# Altium project ESP32-C6-DisplayBoard.PrjPcb
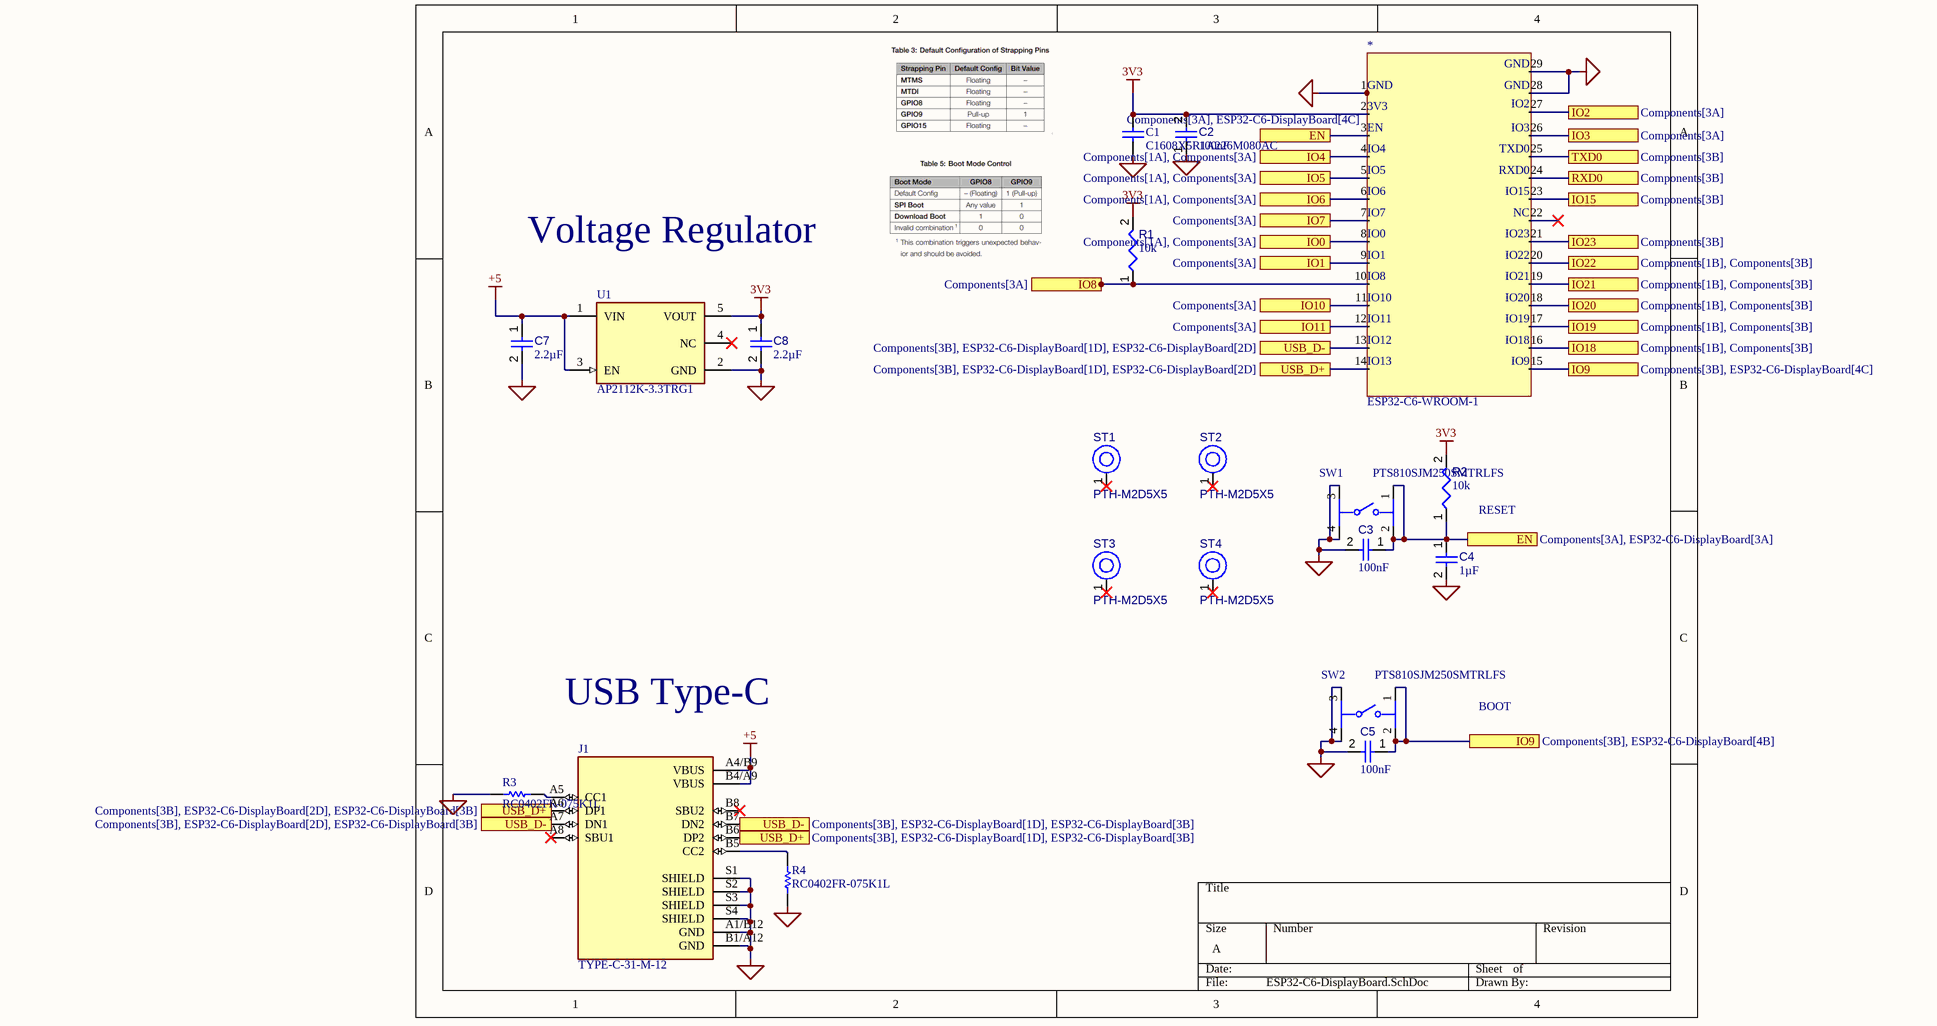
[diagram p0: ESP32-C6-DisplayBoard.SchDoc]
2 sheets, 26 parts. Net scope: flat (ports and power ports of the same name join across sheets).
Board file: ESP32-C6-DisplayBoard.PcbDoc
Sheets:
  ESP32-C6-DisplayBoard.SchDoc
  Components.SchDoc

## Sheet ESP32-C6-DisplayBoard.SchDoc
size A; SheetNumber: 1; SheetTotal: 2

### Parts
*  ESP32-C6-WROOM-1  [PCBComponent_1]
C1  C1608X5R1A226M080AC  [CAPC1608X100X20ML10]
C2  value 100nF  [CAPC1005X56X25LL10T15]  (hidden comment: Capacitor 0.1 uF +/- 5% 16 V 0402)
C3  value 100nF  [CAPC1005X56X25LL10T15]  (hidden comment: Capacitor 0.1 uF +/- 5% 16 V 0402)
C4  value 1µF  [CAPC1005X55X25LL05T10]  (hidden comment: Capacitor 1 uF +/- 10% 6.3 V 0402)
C5  value 100nF  [CAPC1005X56X25LL10T15]  (hidden comment: Capacitor 0.1 uF +/- 5% 16 V 0402)
C7  value 2.2µF  [CAPC0402(1005)60_L]  (hidden comment: Capacitor 2,2µF +/-20% 10V 0402)
C8  value 2.2µF  [CAPC0402(1005)60_L]  (hidden comment: Capacitor 2,2µF +/-20% 10V 0402)
J1  TYPE-C-31-M-12  [HRO_TYPE-C-31-M-12]
R1  value 10k  [RESC0402(1005)_L]  (hidden comment: 10KR2F)
R2  value 10k  [RESC0402(1005)_L]  (hidden comment: 10KR2F)
R3  RC0402FR-075K1L  [RESC1005X40X25NL05T10]
R4  RC0402FR-075K1L  [RESC1005X40X25NL05T10]
ST1  PTH-M2D5X5  [PTH-M2D5X5]
ST2  PTH-M2D5X5  [PTH-M2D5X5]
ST3  PTH-M2D5X5  [PTH-M2D5X5]
ST4  PTH-M2D5X5  [PTH-M2D5X5]
SW1  PTS810SJM250SMTRLFS  [FP-PTS810SJM250SMTRLFS-MFG]
SW2  PTS810SJM250SMTRLFS  [FP-PTS810SJM250SMTRLFS-MFG]
U1  AP2112K-3.3TRG1  [FP-SOT25-IPC_A]

### Ports
EN (see Components[3A], ESP32-C6-DisplayBoard[3A]), EN (see Components[3A], ESP32-C6-DisplayBoard[4C]), IO0 (see Components[1A], Components[3A]), IO1 (see Components[3A]), IO2 (see Components[3A]), IO3 (see Components[3A]), IO4 (see Components[1A], Components[3A]), IO5 (see Components[1A], Components[3A]), IO6 (see Components[1A], Components[3A]), IO7 (see Components[3A]), IO8 (see Components[3A]), IO9 (see Components[3B], ESP32-C6-DisplayBoard[4B]), IO9 (see Components[3B], ESP32-C6-DisplayBoard[4C]), IO10 (see Components[3A]), IO11 (see Components[3A]), IO15 (see Components[3B]), IO18 (see Components[1B], Components[3B]), IO19 (see Components[1B], Components[3B]), IO20 (see Components[1B], Components[3B]), IO21 (see Components[1B], Components[3B]), IO22 (see Components[1B], Components[3B]), IO23 (see Components[3B]), RXD0 (see Components[3B]), TXD0 (see Components[3B]), USB_D+ (see Components[3B], ESP32-C6-DisplayBoard[1D], ESP32-C6-DisplayBoard[2D]), USB_D+ (see Components[3B], ESP32-C6-DisplayBoard[1D], ESP32-C6-DisplayBoard[3B]), USB_D+ (see Components[3B], ESP32-C6-DisplayBoard[2D], ESP32-C6-DisplayBoard[3B]), USB_D- (see Components[3B], ESP32-C6-DisplayBoard[1D], ESP32-C6-DisplayBoard[2D]), USB_D- (see Components[3B], ESP32-C6-DisplayBoard[1D], ESP32-C6-DisplayBoard[3B]), USB_D- (see Components[3B], ESP32-C6-DisplayBoard[2D], ESP32-C6-DisplayBoard[3B])

### Nets
3V3: *.2 C1.2 C2.2 C8.1 R1.2 R2.2 U1.5(VOUT)
+5: C7.1 J1.A4/B9(VBUS) J1.B4/A9(VBUS) U1.1(VIN) U1.3(EN)
GND: *.1 *.28 *.29 C1.1 C2.1 C3.2 C4.2 C5.2 C7.2 C8.2 J1.A1/B12(GND) J1.B1/A12(GND) J1.S1(SHIELD) J1.S2(SHIELD) J1.S3(SHIELD) J1.S4(SHIELD) R3.1 R4.1 SW1.3 SW1.4 SW2.3 SW2.4 U1.2(GND)
Net*_3: *.3 C3.1 C4.1 R2.1 SW1.1 SW1.2 ; port EN
Net*_4: *.4 ; port IO4
Net*_5: *.5 ; port IO5
Net*_6: *.6 ; port IO6
Net*_7: *.7 ; port IO7
Net*_8: *.8 ; port IO0
Net*_9: *.9 ; port IO1
Net*_10: *.10 R1.1 ; port IO8
Net*_11: *.11 ; port IO10
Net*_12: *.12 ; port IO11
Net*_13: *.13 J1.A7(DN1) J1.B7(DN2) ; port USB_D-
Net*_14: *.14 J1.A6(DP1) J1.B6(DP2) ; port USB_D+
Net*_15: *.15 C5.1 SW2.1 SW2.2 ; port IO9
Net*_16: *.16 ; port IO18
Net*_17: *.17 ; port IO19
Net*_18: *.18 ; port IO20
Net*_19: *.19 ; port IO21
Net*_20: *.20 ; port IO22
Net*_21: *.21 ; port IO23
Net*_23: *.23 ; port IO15
Net*_24: *.24 ; port RXD0
Net*_25: *.25 ; port TXD0
Net*_26: *.26 ; port IO3
Net*_27: *.27 ; port IO2
NetJ1_A5: J1.A5(CC1) R3.2
NetJ1_B5: J1.B5(CC2) R4.2

Not connected (* = marked no-connect by the designer): * 22*; J1 A8(SBU1)* B8(SBU2)*; ST1 1(H1)*; ST2 1(H1)*; ST3 1(H1)*; ST4 1(H1)*; U1 4(NC)*

### Notes on the sheet
- Voltage Regulator
- RESET
- USB Type-C
- BOOT
- (in symbol CMP-001-0002-6) GND; 3V3; IO2; EN; IO3; IO4; TXD0; IO5; RXD0; IO6; IO15; IO7; NC; IO0; IO23; IO1; IO22; IO8; IO21; IO10; IO20; IO11; IO19; IO12; IO18; IO13; IO9

### Library data of the parts
* = CMP-001-0002-6: ESP32-C6-WROOM-1 Module
C1 = CMP-2000-05441-1: Chip Capacitor, 22 uF, +/- 20%, 10 V, -55 to 85 degC, 0603 (1608 Metric), RoHS, Tape and Reel; Manufacturer: TDK; PCN Part Number: MLCCPartNumberChange30/Nov/2012; Voltage - Rated: 10V; Product Training Modules: CSeriesGeneralApplicationsSEAT,CCV,andTVCLDesignToolsGuidetoReplacinganElectrolyticCapacitorwithanMLCC; Other Names: 445-9077-1; Design Resources: 20WNon-IsolatedBuckLEDDriverUsingPLLNK460KG; Online Catalog: CSeries,GeneralPurpose; Capacitance: 22µF; Temperature Coefficient: X5R; Kits: 445-9014-KIT-ND-KITMLCC100PF-22UF060310-50V; Packaging: CutTape(CT); Standard Package: 1; Package / Case: 0603(1608Metric); Lead Style: -; Features: -; Ratings: -; Operating Temperature: -55degC~85degC; Applications: GeneralPurpose; Package Reference: 603; Datasheet URL: http://download.siliconexpert.com/pdfs/2015/4/21/15/54/45/779/tdk_/manual/37024850441143360mlcc_commercial_general_en.pdf; Datasheet Version: Mar-15; Mounting Type: SurfaceMount,MLCC; Lead Spacing: -; Size / Dimension: 0.063"Lx0.031"W(1.60mmx0.80mm); Height - Seated (Max): -; Package Description: 2-Pin Surface Mount Device, Body 1.6 x 0.8 mm; Manufacturer URL: http://www.tdk.com/; RoHS Information: RoHSCertificate-MLCC; Tolerance: ±20%; Series: C; Thickness (Max): 0.035"(0.90mm); Family: CeramicCapacitors; Category: Capacitors
C2 C3 C5 = CMP-001-00001-6: Chip Capacitor, 0.1 uF, +/- 5%, 16 V, 0402 (1005 Metric); Capacitor Type: Ceramic; Voltage Rating: 16V; Max Operating Temperature: 125°C; Min Operating Temperature: -55°C; Case/Package: 0402; Mounting Technology: SM; Pins: 2; Tolerance: 5%; RoHS Compliant: True
C4 = CMP-001-00008-6: Chip Capacitor, 1 uF, +/- 10%, 6.3 V, 0402 (1005 Metric); Capacitor Type: Ceramic; Voltage Rating: 6.3V; Max Operating Temperature: 85°C; Mounting Technology: SM; Tolerance: 10%; Case/Package: 0402; RoHS Compliant: True; Min Operating Temperature: -55°C; Pins: 2
C7 C8 = CMP-001-00056-4: Chip Capacitor, 2,2µF +/-20%, 10V, 0402, Thickness 0.6 mm; Tolerance: 10%; Mounting Technology: SMT; Max Operating Temperature: 85°C; Case/Package: 0402; Pins: 2; Min Operating Temperature: -55°C; Voltage Rating: 10V
J1 = CMP-005-000000-1: USB Connectors 24 Receptacle 1 8.94*7.3mm RoHS; MF: HRO Electronics Co., Ltd.; Pin Count: 16; Design Item ID: TYPE-C-31-M-12; Component Type: Standard; Price: None; Check_prices: https://www.snapeda.com/parts/TYPE-C-31-M-12/HRO+Electronics+Co.%252C+Ltd./view-part/?ref=eda; Value: *; MP: TYPE-C-31-M-12; Source: TYPE-C-31-M-12.SchLib; Availability: Not in stock; SnapEDA_Link: https://www.snapeda.com/parts/TYPE-C-31-M-12/HRO+Electronics+Co.%252C+Ltd./view-part/?ref=snap; Package: Package
R1 R2 = CMP-009-00066-2: 10K 0.063W 1% 0402 (1005 Metric)  SMD; Power: 63mW; Case/Package: 0402; Mounting Technology: SMT; Pins: 2; Tolerance: 1%
R3 R4 = CMP-2002-07753-1: Manufacturer: Yageo / Phycomp; Part Number: RC0402FR-075K1L
ST1-ST4 = CMP-00028-00004-2: M2 PTH (2.5mm), 5mm pad; Pins: 1
SW1 SW2 = CMP-10040-000001-2: SWITCH TACTILE SPST-NO 0.05A 16V; Throw Configuration: SPST; Operating Force: 160gf; Actuator Type: Standard; Switch Travel: 0.15mm; Switch Function: Off-Mom; Max Current Rating: 50mA; Mechanical Life: 150000Cycles; Illumination Type: Non-Illuminated; Package Quantity: 2900; Depth: 4.6mm; Mount: Surface Mount; Packaging: Tape and Reel; Length: 3.2mm; RoHS Compliant: Yes; Case/Package: SMD/SMT; Voltage Rating (DC): 16V; Min Operating Temperature: -40°C; Termination: J-Bend; Lead Free: Lead Free; Contact Plating: Silver; Orientation: Straight; Max Operating Temperature: 85°C; Current Rating: 50mA; Color: Black
U1 = CMP-12756-000035-1: IC REG LINEAR 3.3V 600MA SOT25; Number of Regulators: 1; Output Type: Fixed; Polarity: Positive; Min Input Voltage: 2.5V; Max Input Voltage: 6V; Accuracy: 1.5%; Quiescent Current: 55uA; Dropout Voltage: 250mV; Min Operating Temperature: -40°C; Length: 3.1mm; Output Current: 600mA; Max Operating Temperature: 85°C; Package Quantity: 1; Output Voltage: 3.3V; Width: 1.7mm; Number of Outputs: 1; Packaging: Tape and Reel; Height: 1.3mm; Lead Free: Lead Free; Max Output Current: 600mA; Case/Package: SOT-23-5; Mount: Surface Mount; Number of Pins: 5

## Sheet Components.SchDoc
size 400 x 265 mm; SheetNumber: 2; SheetTotal: 2
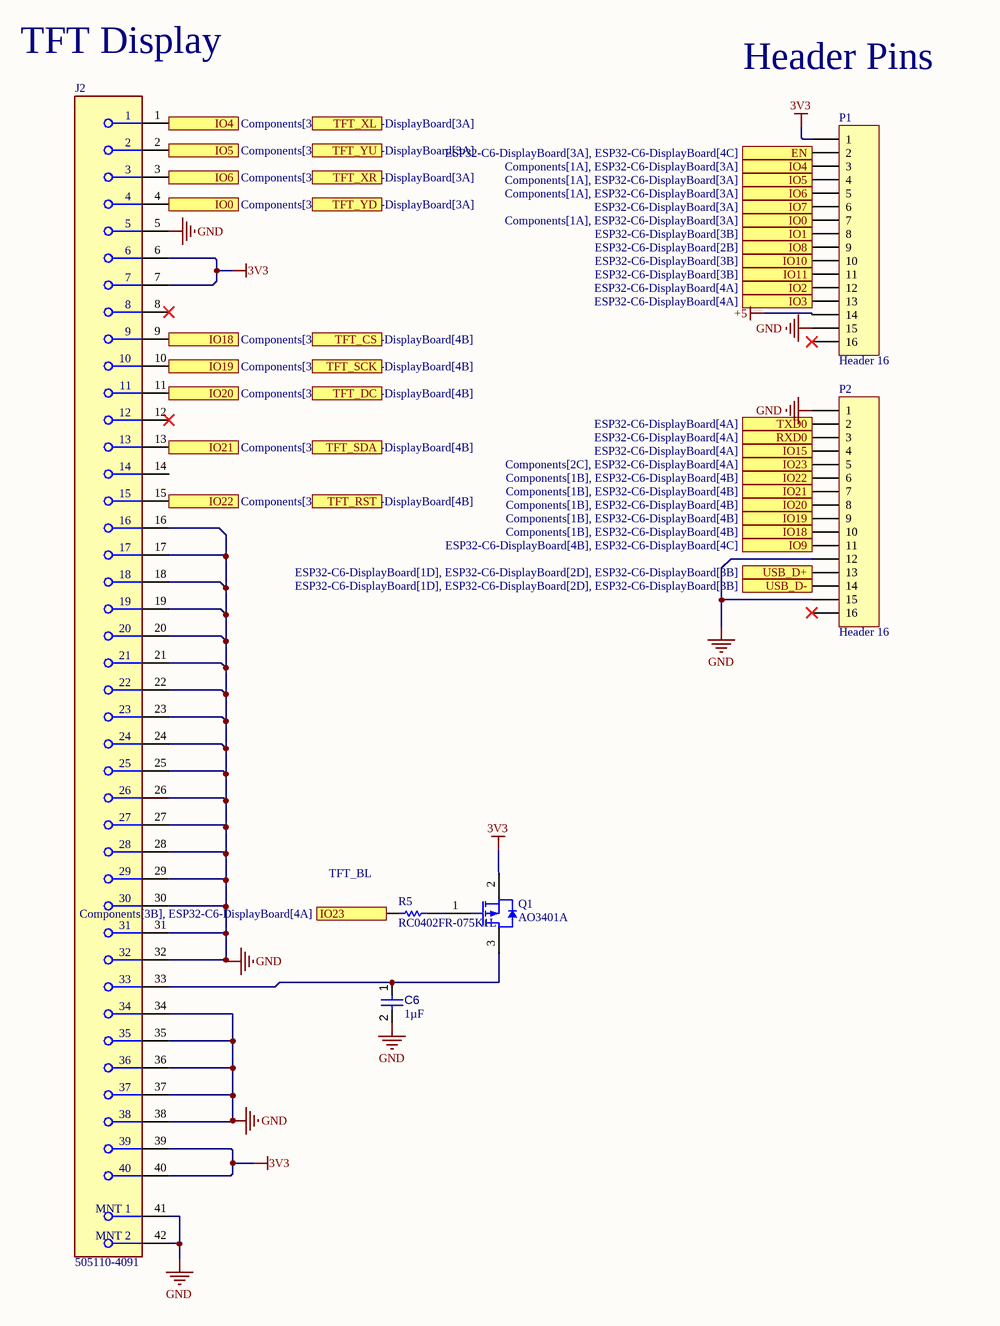
[diagram p1: Components.SchDoc]

### Parts
C6  value 1µF  [CAPC1005X55X25LL05T10]  (hidden comment: Capacitor 1 uF +/- 10% 6.3 V 0402)
J2  505110-4091  [FP-505110-4091-MFG]
P1  Header 16  [HDR1X16]
P2  Header 16  [HDR1X16]
Q1  AO3401A  [AO-SOT-23-3L_V]
R5  RC0402FR-075K1L  [RESC1005X40X25NL05T10]

### Ports
EN (see ESP32-C6-DisplayBoard[3A], ESP32-C6-DisplayBoard[4C]), IO0 (see Components[1A], ESP32-C6-DisplayBoard[3A]), IO0 (see Components[3A], ESP32-C6-DisplayBoard[3A]), IO1 (see ESP32-C6-DisplayBoard[3B]), IO2 (see ESP32-C6-DisplayBoard[4A]), IO3 (see ESP32-C6-DisplayBoard[4A]), IO4 (see Components[1A], ESP32-C6-DisplayBoard[3A]), IO4 (see Components[3A], ESP32-C6-DisplayBoard[3A]), IO5 (see Components[1A], ESP32-C6-DisplayBoard[3A]), IO5 (see Components[3A], ESP32-C6-DisplayBoard[3A]), IO6 (see Components[1A], ESP32-C6-DisplayBoard[3A]), IO6 (see Components[3A], ESP32-C6-DisplayBoard[3A]), IO7 (see ESP32-C6-DisplayBoard[3A]), IO8 (see ESP32-C6-DisplayBoard[2B]), IO9 (see ESP32-C6-DisplayBoard[4B], ESP32-C6-DisplayBoard[4C]), IO10 (see ESP32-C6-DisplayBoard[3B]), IO11 (see ESP32-C6-DisplayBoard[3B]), IO15 (see ESP32-C6-DisplayBoard[4A]), IO18 (see Components[1B], ESP32-C6-DisplayBoard[4B]), IO18 (see Components[3B], ESP32-C6-DisplayBoard[4B]), IO19 (see Components[1B], ESP32-C6-DisplayBoard[4B]), IO19 (see Components[3B], ESP32-C6-DisplayBoard[4B]), IO20 (see Components[1B], ESP32-C6-DisplayBoard[4B]), IO20 (see Components[3B], ESP32-C6-DisplayBoard[4B]), IO21 (see Components[1B], ESP32-C6-DisplayBoard[4B]), IO21 (see Components[3B], ESP32-C6-DisplayBoard[4B]), IO22 (see Components[1B], ESP32-C6-DisplayBoard[4B]), IO22 (see Components[3B], ESP32-C6-DisplayBoard[4B]), IO23 (see Components[2C], ESP32-C6-DisplayBoard[4A]), IO23 (see Components[3B], ESP32-C6-DisplayBoard[4A]), RXD0 (see ESP32-C6-DisplayBoard[4A]), TFT_CS, TFT_DC, TFT_RST, TFT_SCK, TFT_SDA, TFT_XL, TFT_XR, TFT_YD, TFT_YU, TXD0 (see ESP32-C6-DisplayBoard[4A]), USB_D+ (see ESP32-C6-DisplayBoard[1D], ESP32-C6-DisplayBoard[2D], ESP32-C6-DisplayBoard[3B]), USB_D- (see ESP32-C6-DisplayBoard[1D], ESP32-C6-DisplayBoard[2D], ESP32-C6-DisplayBoard[3B])

### Nets
3V3: J2.6 J2.7 J2.39 J2.40 P1.1 Q1.2(SOURCE)
+5: P1.14
GND: C6.2 J2.5 J2.16 J2.17 J2.18 J2.19 J2.20 J2.21 J2.22 J2.23 J2.24 J2.25 J2.26 J2.27 J2.28 J2.29 J2.30 J2.31 J2.32 J2.34 J2.35 J2.36 J2.37 J2.38 J2.41(MNT_1) J2.42(MNT_2) P1.15 P2.1 P2.12 P2.15
Net*_3: P1.2 ; port EN
Net*_4: J2.1 P1.3 ; port IO4
Net*_5: J2.2 P1.4 ; port IO5
Net*_6: J2.3 P1.5 ; port IO6
Net*_7: P1.6 ; port IO7
Net*_8: J2.4 P1.7 ; port IO0
Net*_9: P1.8 ; port IO1
Net*_10: P1.9 ; port IO8
Net*_11: P1.10 ; port IO10
Net*_12: P1.11 ; port IO11
Net*_13: P2.14 ; port USB_D-
Net*_14: P2.13 ; port USB_D+
Net*_15: P2.11 ; port IO9
Net*_16: J2.9 P2.10 ; port IO18
Net*_17: J2.10 P2.9 ; port IO19
Net*_18: J2.11 P2.8 ; port IO20
Net*_19: J2.13 P2.7 ; port IO21
Net*_20: J2.15 P2.6 ; port IO22
Net*_21: P2.5 R5.2 ; port IO23
Net*_23: P2.4 ; port IO15
Net*_24: P2.3 ; port RXD0
Net*_25: P2.2 ; port TXD0
Net*_26: P1.13 ; port IO3
Net*_27: P1.12 ; port IO2
NetC6_1: C6.1 J2.33 Q1.3(DRAIN)
NetQ1_1: Q1.1(GATE) R5.1

Not connected (* = marked no-connect by the designer): J2 8* 12* 14; P1 16*; P2 16*

### Notes on the sheet
- TFT Display
- Header Pins
- (near R5) TFT_BL

### Library data of the parts
C6 = CMP-001-00008-6: as C4 on sheet ESP32-C6-DisplayBoard; Max Operating Temperature: 85°C; Mounting Technology: SM; Tolerance: 10%; Case/Package: 0402; RoHS Compliant: True; Min Operating Temperature: -55°C; Pins: 2
J2 = CMP-04775-000011-1: CONN FFC/FPC BOTTOM 40P .5MM R/A; Actuator Material: Nylon; Mating Cycles: 25; Actuator Color: Black; Voltage Rating: 50V; Number of Circuits: 40; Current Rating: 500mA; Pitch: 0.5mm; Gender: Receptacle; Contact Plating: Gold; Number of Rows: 1; Number of Pins: 40; Termination: Solder; Packaging: Cut Tape; Max Operating Temperature: 105°C; Housing Color: Beige; Mount: Surface Mount; Halogen Free: Low Halogen; Flammability Rating: UL94 V-0; Series: Easy-On 505110; Min Operating Temperature: -40°C; Contact Material: Bronze; Housing Material: Polymer; Height: 1.9mm; Number of Contacts: 40; Number of Positions: 40; Orientation: Right Angle
P1 P2 = Header 16: Header, 16-Pin; LatestRevisionDate: 17-Jul-2002; LatestRevisionNote: Re-released for DXP Platform.; Publisher: Altium Limited
Q1 = CMP-2000-05778-1: P-Channel MOSFET, 30 V, 4 A, -55 to 150 degC, 3-Pin SOT-23-3L, RoHS, Tape and Reel; Manufacturer: Alpha and Omega; Output Power (Max): NotRequiredW; Power Dissipation: 1.4W; Rad Hardened: No; Drain Efficiency: NotRequired%; Drain-Source On-Volt: 30V; Noise Figure: NotRequireddB; Frequency (Max): NotRequiredMHz; Number of  Elements: 1; Gate-Source Voltage (Max): ?12V; Drain Current (Max): 4A; Channel Mode: Enhancement; Drain-Source On-Res: 0.044ohm; Type: PowerMOSFET; Polarity: P; Package URL: http://www.aosmd.com/res/packaging_information/SOT-23-3L.pdf; Datasheet URL: http://www.aosmd.com/res/data_sheets/AO3401A.pdf; Package Type: SOT-23; Package Description: 3-Pin Small Outline Transistor, Body 2.95 x 1.6 mm, Pitch 0.95 mm; Mounting: SurfaceMount; Manufacturer URL: http://www.aosmd.com/; Continuous Drain Current: 4A; Package Reference: SOT-23-3L; Mounting Technology: SurfaceMount; Operating Temperature Classification: Military; Power Gain: NotRequireddB; Datasheet Version: Rev. 3, 03/2011; Operating Temp Range: -55Cto150C; Pin Count: 3
R5 = CMP-2002-07753-1: Manufacturer: Yageo / Phycomp; Part Number: RC0402FR-075K1L

## Nets that join several sheets
3V3: ESP32-C6-DisplayBoard (7 pins), Components (6 pins)
+5: ESP32-C6-DisplayBoard (5 pins), Components (P1.14)
GND: ESP32-C6-DisplayBoard (23 pins), Components (30 pins)
Net*_3: ESP32-C6-DisplayBoard (6 pins), Components (P1.2)
Net*_4: ESP32-C6-DisplayBoard (*.4), Components (J2.1 P1.3)
Net*_5: ESP32-C6-DisplayBoard (*.5), Components (J2.2 P1.4)
Net*_6: ESP32-C6-DisplayBoard (*.6), Components (J2.3 P1.5)
Net*_7: ESP32-C6-DisplayBoard (*.7), Components (P1.6)
Net*_8: ESP32-C6-DisplayBoard (*.8), Components (J2.4 P1.7)
Net*_9: ESP32-C6-DisplayBoard (*.9), Components (P1.8)
Net*_10: ESP32-C6-DisplayBoard (*.10 R1.1), Components (P1.9)
Net*_11: ESP32-C6-DisplayBoard (*.11), Components (P1.10)
Net*_12: ESP32-C6-DisplayBoard (*.12), Components (P1.11)
Net*_13: ESP32-C6-DisplayBoard (*.13 J1.A7 J1.B7), Components (P2.14)
Net*_14: ESP32-C6-DisplayBoard (*.14 J1.A6 J1.B6), Components (P2.13)
Net*_15: ESP32-C6-DisplayBoard (*.15 C5.1 SW2.1 SW2.2), Components (P2.11)
Net*_16: ESP32-C6-DisplayBoard (*.16), Components (J2.9 P2.10)
Net*_17: ESP32-C6-DisplayBoard (*.17), Components (J2.10 P2.9)
Net*_18: ESP32-C6-DisplayBoard (*.18), Components (J2.11 P2.8)
Net*_19: ESP32-C6-DisplayBoard (*.19), Components (J2.13 P2.7)
Net*_20: ESP32-C6-DisplayBoard (*.20), Components (J2.15 P2.6)
Net*_21: ESP32-C6-DisplayBoard (*.21), Components (P2.5 R5.2)
Net*_23: ESP32-C6-DisplayBoard (*.23), Components (P2.4)
Net*_24: ESP32-C6-DisplayBoard (*.24), Components (P2.3)
Net*_25: ESP32-C6-DisplayBoard (*.25), Components (P2.2)
Net*_26: ESP32-C6-DisplayBoard (*.26), Components (P1.13)
Net*_27: ESP32-C6-DisplayBoard (*.27), Components (P1.12)